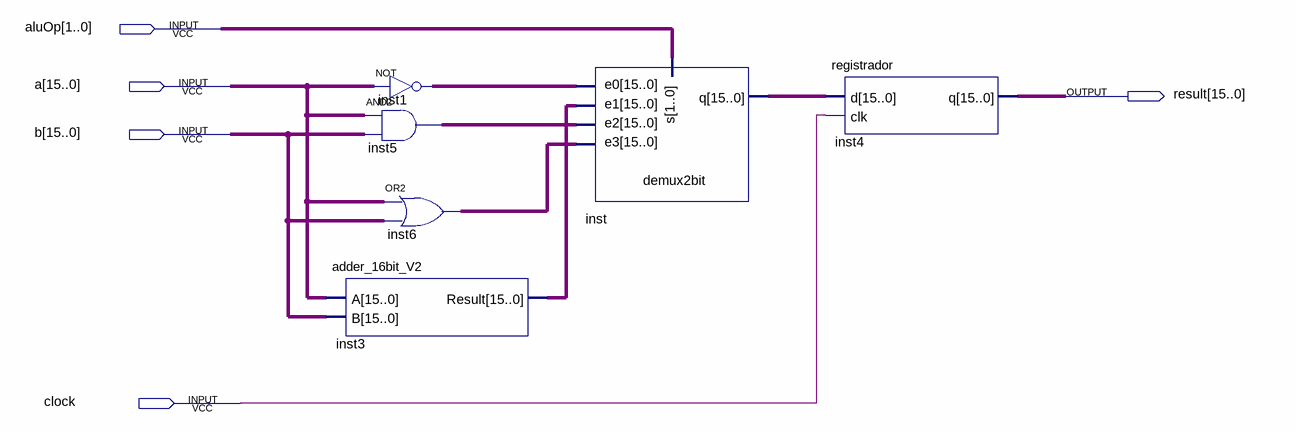
[diagram p0: schematic sheet]
// Quartus schematic ALU.bdf as structural Verilog: 6 symbols, 5 pins
module ALU (
  input  [1:0] aluOp,
  input  [15:0] a,
  input  [15:0] b,
  input  clock,
  output [15:0] result
);

  wire [15:0] inst1_out, inst3_result, inst5_out, inst6_out, inst_q;

  adder_16bit_V2 inst3 (.A(a), .B(b), .Result(inst3_result));
  assign inst1_out = ~a;  // NOT inst1, 16 bits wide
  assign inst5_out = a & b;  // AND2 inst5, 16 bits wide
  assign inst6_out = a | b;  // OR2 inst6, 16 bits wide
  demux2bit inst (.s(aluOp), .e0(inst1_out), .e1(inst3_result), .e2(inst5_out), .e3(inst6_out), .q(inst_q));
  registrador inst4 (.d(inst_q), .clk(clock), .q(result));
endmodule
